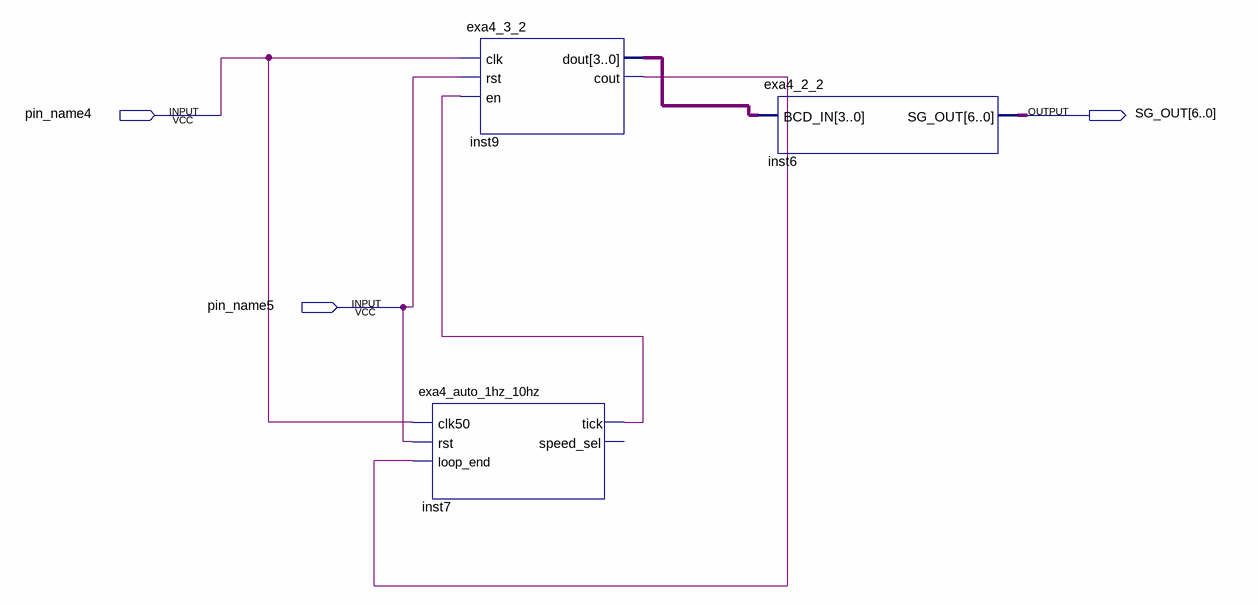
[diagram p0: schematic sheet]
// Quartus schematic experiment_four_task5.bdf as structural Verilog: 3 symbols, 3 pins
module experiment_four_task5 (
  input  pin_name4,
  input  pin_name5,
  output [6:0] SG_OUT
);

  wire inst7_tick, inst9_cout;
  wire [3:0] inst9_dout;

  exa4_3_2 inst9 (.clk(pin_name4), .rst(pin_name5), .en(inst7_tick), .dout(inst9_dout), .cout(inst9_cout));
  exa4_auto_1hz_10hz inst7 (
    .clk50(pin_name4), .rst(pin_name5), .loop_end(inst9_cout), .tick(inst7_tick));  // open: speed_sel
  exa4_2_2 inst6 (.BCD_IN(inst9_dout), .SG_OUT(SG_OUT));
endmodule
